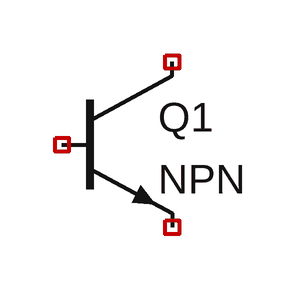
[diagram p0: schematic Draft3.asc]
Draft3.asc, the LTspice schematic file:
Version 4
SHEET 1 880 680
SYMBOL npn 160 176 R0
SYMATTR InstName Q1

The netlist it stands for:
* Draft3.asc
Q1 NC_01 NC_02 NC_03 0 NPN
.model NPN NPN
.model PNP PNP
.lib standard.bjt
.backanno
.end